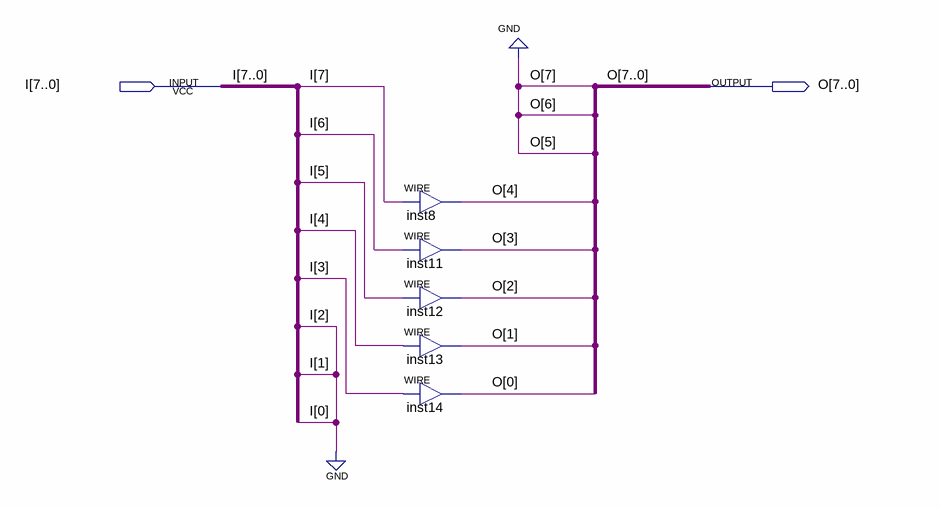
[diagram p0: schematic sheet]
// Quartus schematic Shift-3-Right_8bit.bdf as structural Verilog: 5 symbols, 2 pins
module \Shift-3-Right_8bit  (
  input  [7:0] I,
  output [7:0] O
);

  assign O[4] = I[7];  // WIRE inst8
  assign O[3] = I[6];  // WIRE inst11
  assign O[2] = I[5];  // WIRE inst12
  assign O[1] = I[4];  // WIRE inst13
  assign O[0] = I[3];  // WIRE inst14

  assign I[1:0] = {2{I[2]}};
  assign O[7:5] = 3'b000;
  // also tied to GND on the sheet: I[2]
endmodule
